# Altium schematic sheet Battery.SchDoc
size A3; SheetNumber: 1; SheetTotal: 1
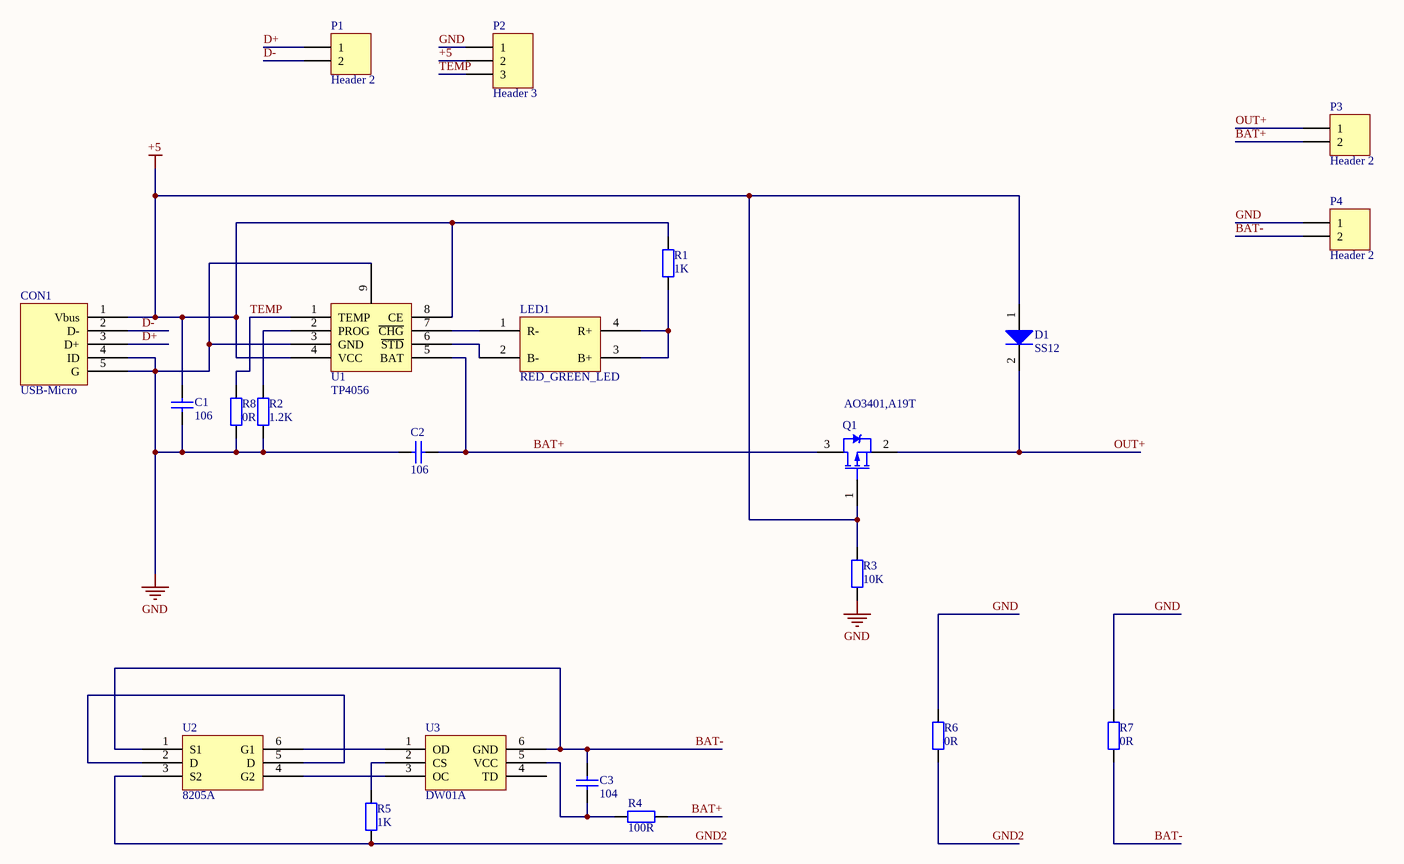
[diagram p0: Battery.SchDoc]

## Parts
C1  value 106  [CAPC1608L]  (hidden comment: Cap)
C2  value 106  [CAPC1608L]  (hidden comment: Cap)
C3  value 104  [CAPC1608L]  (hidden comment: Cap)
CON1  USB-Micro  [USB-micro_B]
D1  SS12  [DO-214AC]
LED1  RED_GREEN_LED  [RED_GREEN_LED1206]
P1  Header 2  [HDR1X2]
P2  Header 3  [HDR1X3]
P3  Header 2  [HDR1X2]
P4  Header 2  [HDR1X2]
Q1  AO3401,A19T  [SOT-23B_L]
R1  value 1K  [RESC1608L]  (hidden comment: Res2)
R2  value 1.2K  [RESC1608L]  (hidden comment: Res2)
R3  value 10K  [RESC1608L]  (hidden comment: Res2)
R4  value 100R  [RESC1608L]  (hidden comment: Res2)
R5  value 1K  [RESC1608L]  (hidden comment: Res2)
R6  value 0R  [RESC1608L]  (hidden comment: Res2)
R7  value 0R  [RESC1608L]  (hidden comment: Res2)
R8  value 0R  [RESC1608L]  (hidden comment: Res2)
U1  TP4056  [SOP127P780-8M]
U2  8205A  [SOT95P330-6M]
U3  DW01A  [SOT95P330-6M]

## Nets
+5: C1.2 CON1.1(Vbus) D1.1(A) P2.2 Q1.1(G) R1.2 R3.2 U1.4(VCC) U1.8(CE)
GND: C1.1 C2.2 CON1.4(ID) CON1.5(G) P2.1 P4.1 R2.1 R3.1 R6.2 R7.2 R8.1 U1.3(GND) U1.9
BAT+: C2.1 P3.2 Q1.3(D) R4.1 U1.5(BAT)
BAT-: C3.1 P4.2 R7.1 U2.1(S1) U3.6(GND)
D+: CON1.3(D+) P1.1
D-: CON1.2(D-) P1.2
GND2: R5.1 R6.1 U2.3(S2)
OUT+: D1.2(K) P3.1 Q1.2(S)
TEMP: P2.3 R8.2 U1.1(TEMP)
NetC3_2: C3.2 R4.2 U3.5(VCC)
NetLED1_1: LED1.1(R-) U1.7(~{CHG})
NetLED1_2: LED1.2(B-) U1.6(~{STD})
NetLED1_3: LED1.3(B+) LED1.4(R+) R1.1
NetR2_2: R2.2 U1.2(PROG)
NetR5_2: R5.2 U3.2(CS)
NetU2_2: U2.2(D) U2.5(D)
NetU2_4: U2.4(G2) U3.3(OC)
NetU2_6: U2.6(G1) U3.1(OD)

Not connected (* = marked no-connect by the designer): U3 4(TD)

## Library data of the parts
C1-C3 = Cap: Capacitor; Published: 8-Jun-2000; LatestRevisionDate: 17-Jul-2002; LatestRevisionNote: Re-released for DXP Platform.; PackageReference: RAD-0.3; Publisher: Altium Limited; PackageDescription: Radial Cap, Thru-Hole; 2 Leads; 0.3 in Pin Spacing
D1 = Diode: 1N4148; Published: 8-Jun-2000; LatestRevisionDate: 17-Jul-2002; LatestRevisionNote: Re-released for DXP Platform.; PackageVersion: Sep-1996; PackageReference: SMC; Publisher: Altium Limited; PackageDescription: DO-214-AB/SMC; 2 C-Bend Leads; Body 7.9 x 5.9 mm, inc. leads (LxW); Code_JEDEC: DO-214-AB
P1 P3 P4 = Header 2: Header, 2-Pin; LatestRevisionDate: 17-Jul-2002; LatestRevisionNote: Re-released for DXP Platform.; Publisher: Altium Limited
P2 = Header 3: Header, 3-Pin; LatestRevisionDate: 17-Jul-2002; LatestRevisionNote: Re-released for DXP Platform.; Publisher: Altium Limited
Q1 = PMOS-2: P-Channel Power MOSFET; Note: Pin 4 not drawn and electrically connected to Pin 2.; Published: 8-Jun-2000; LatestRevisionDate: 17-Jul-2002; LatestRevisionNote: Re-released for DXP Platform.; DatasheetVersion: PD-9.390D; PackageVersion: Feb-1997; PackageReference: TO-220AB; Publisher: Altium Limited; PackageDescription: TO, Thru-Hole, Vertical, Heatsink Mounted; 3 In-Line Leads; Pitch 2.54 mm; ComponentLink1Description: Manufacturer Link; ComponentLink1URL: http://www.irf.com/
R1-R8 = Res2: Resistor; Published: 8-Jun-2000; LatestRevisionDate: 17-Jul-2002; LatestRevisionNote: Re-released for DXP Platform.; PackageReference: AXIAL-0.4; Publisher: Altium Limited; PackageDescription: Axial Device, Thru-Hole; 2 Leads; 0.4 in Pin Spacing